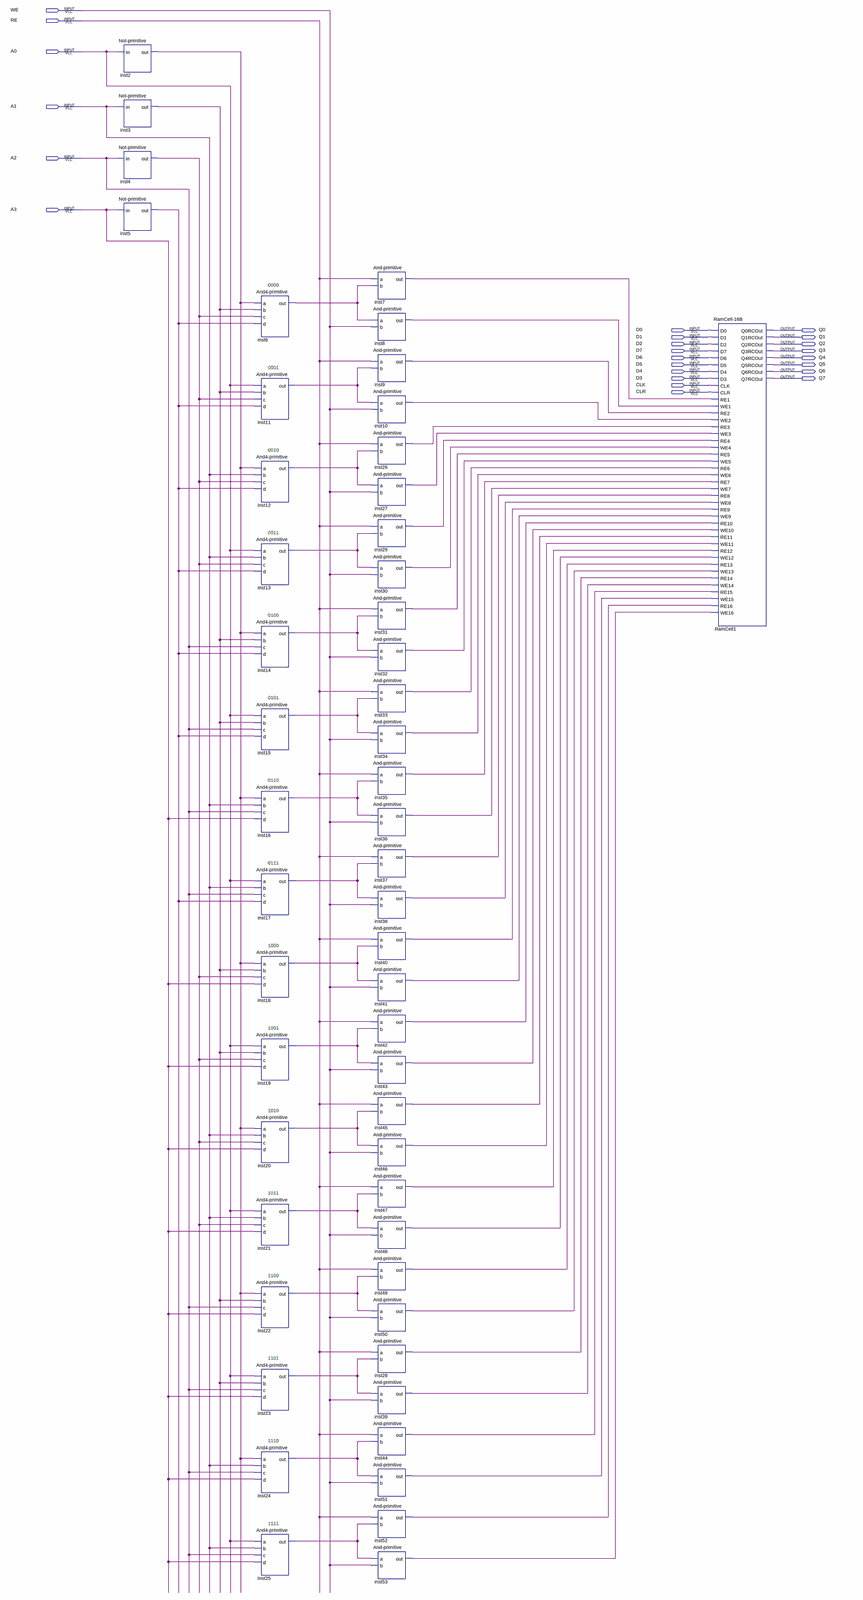
[diagram p0: schematic sheet, whole]
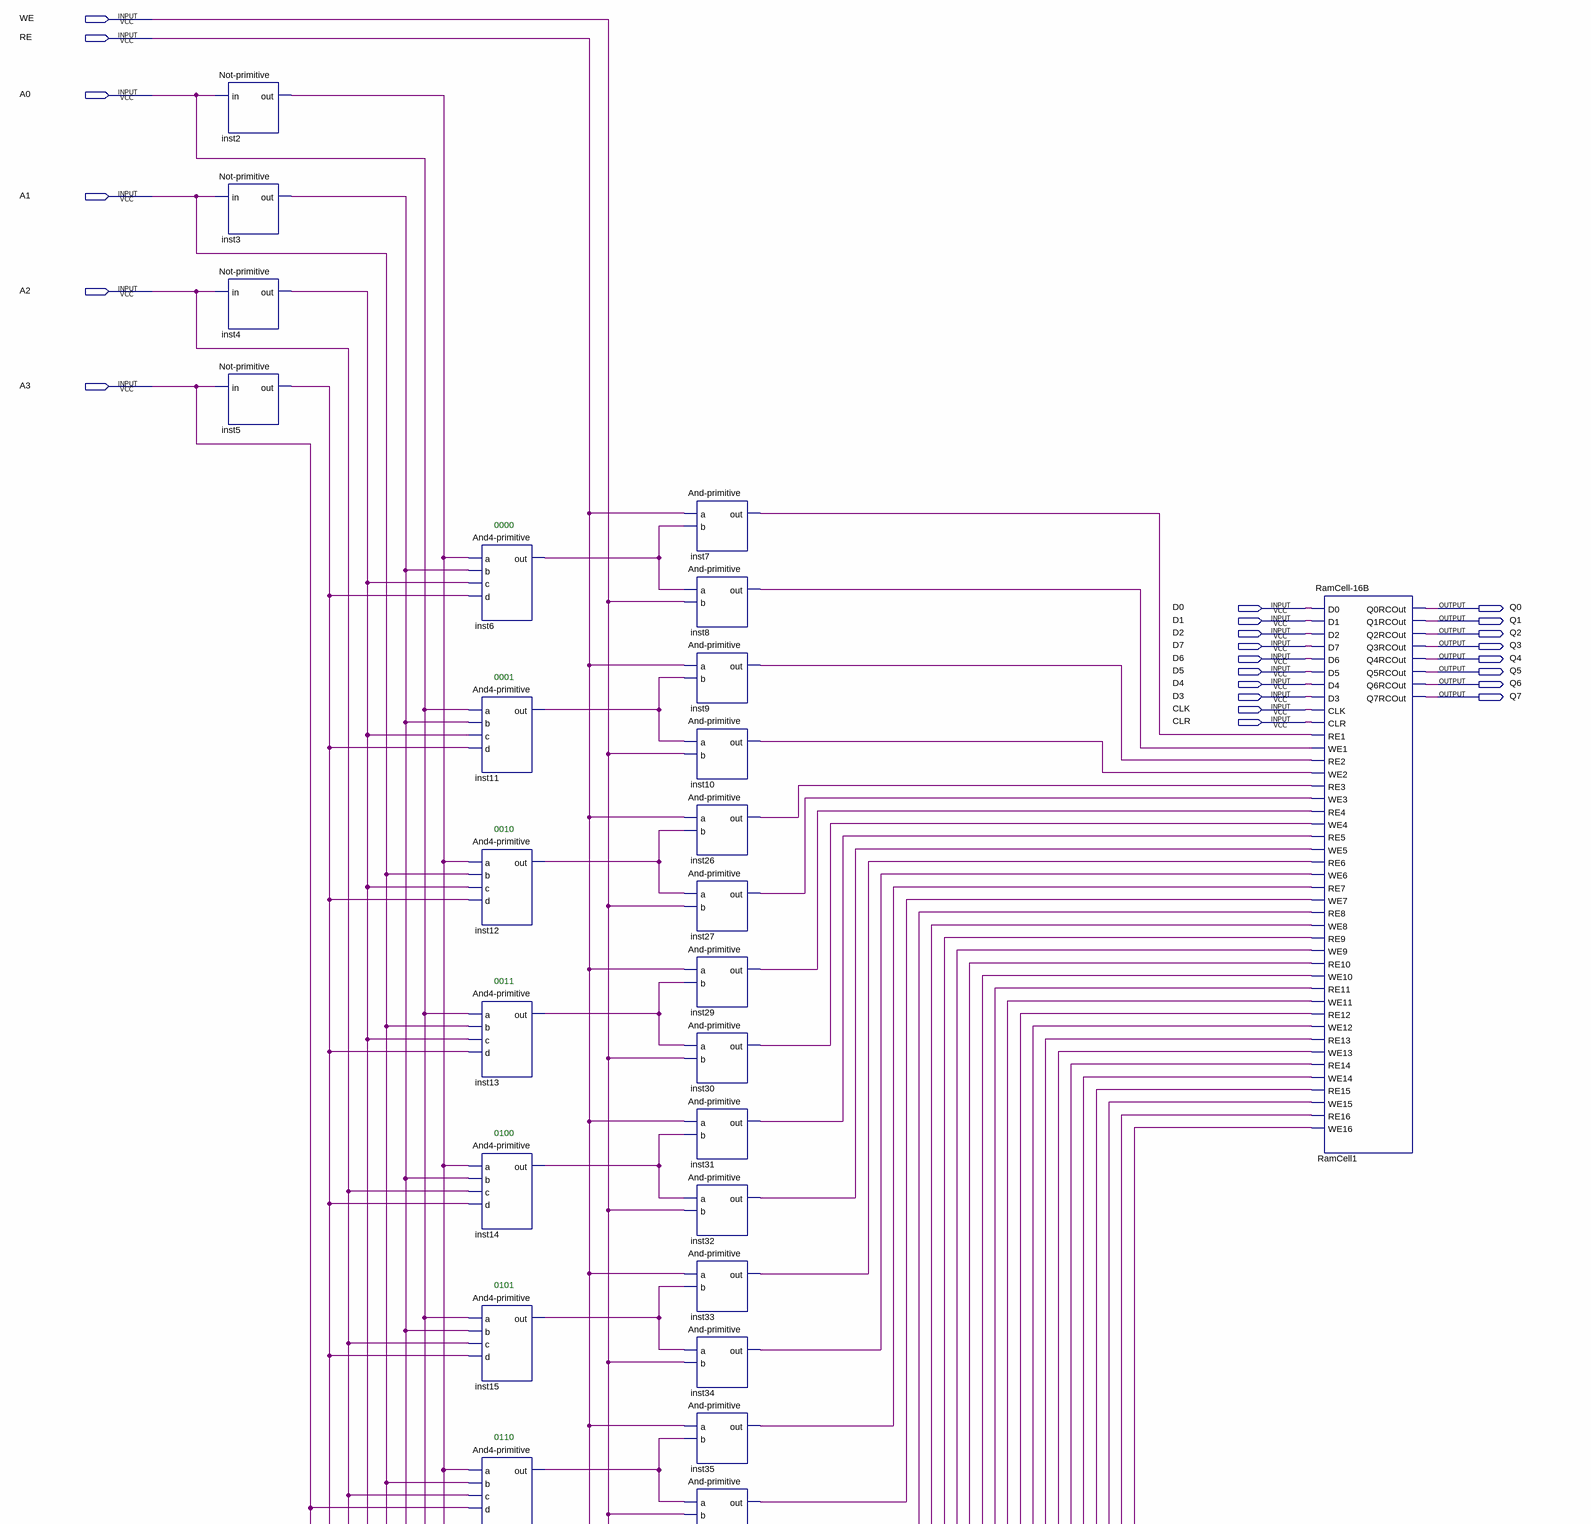
[diagram p1: schematic sheet, upper part]
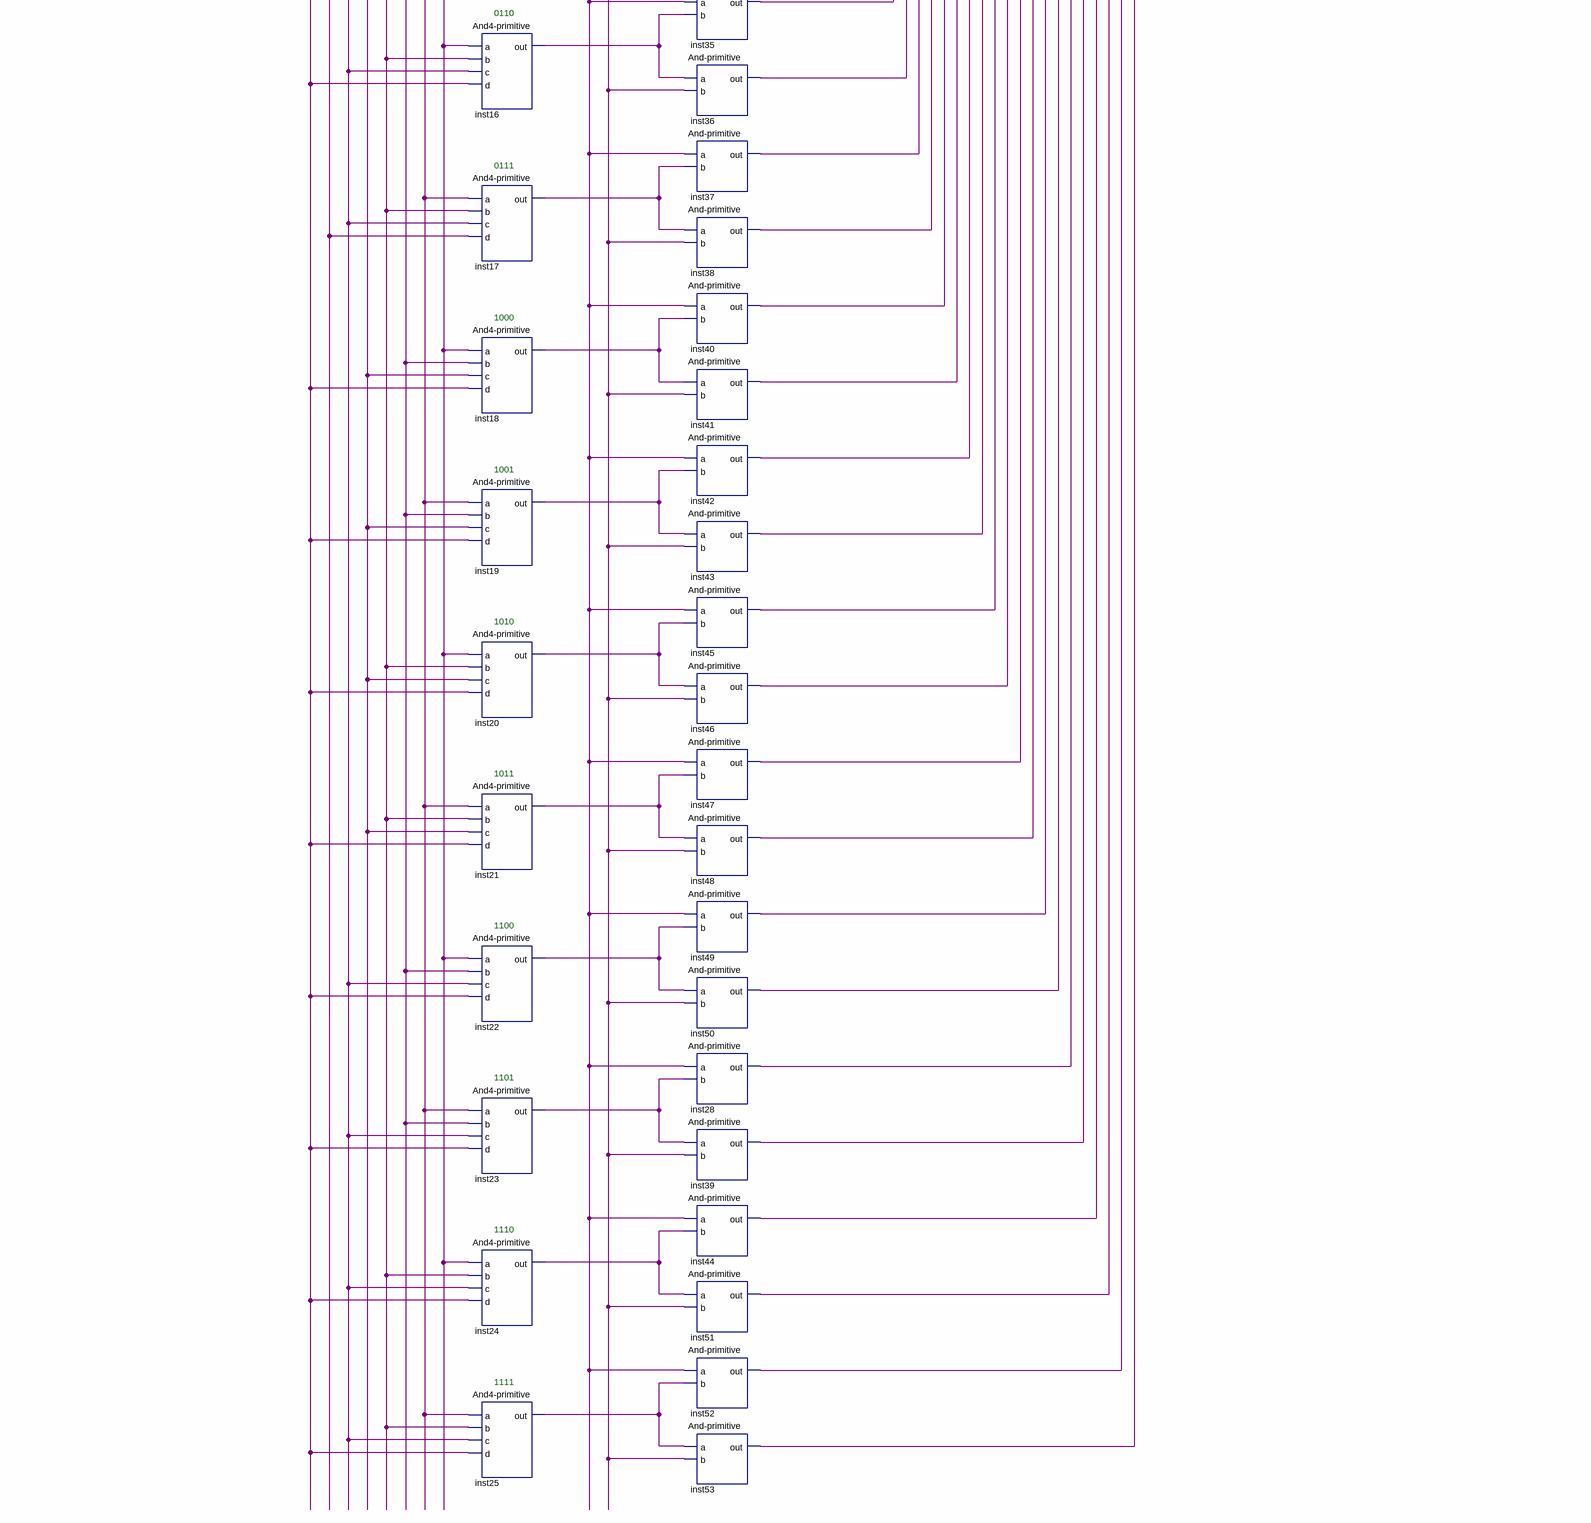
[diagram p2: schematic sheet, lower part]
// Quartus schematic RAM.bdf as structural Verilog: 53 symbols, 24 pins
module RAM (
  input  WE,
  input  RE,
  input  A0,
  input  A1,
  input  A2,
  input  A3,
  input  D0,
  input  D1,
  input  D2,
  input  D7,
  input  D6,
  input  D5,
  input  D4,
  input  D3,
  input  CLK,
  input  CLR,
  output Q0,
  output Q1,
  output Q2,
  output Q3,
  output Q4,
  output Q5,
  output Q6,
  output Q7
);

  wire inst2_out, inst3_out, inst4_out, inst5_out, inst6_out, inst7_out, inst8_out, inst9_out, inst10_out,
       inst11_out, inst12_out, inst13_out, inst14_out, inst15_out, inst16_out, inst17_out, inst18_out,
       inst19_out, inst20_out, inst21_out, inst22_out, inst23_out, inst24_out, inst25_out, inst26_out,
       inst27_out, inst28_out, inst29_out, inst30_out, inst31_out, inst32_out, inst33_out, inst34_out,
       inst35_out, inst36_out, inst37_out, inst38_out, inst39_out, inst40_out, inst41_out, inst42_out,
       inst43_out, inst44_out, inst45_out, inst46_out, inst47_out, inst48_out, inst49_out, inst50_out,
       inst51_out, inst52_out, inst53_out;

  \Not-primitive  inst2 (.in(A0), .out(inst2_out));
  \Not-primitive  inst3 (.in(A1), .out(inst3_out));
  \Not-primitive  inst4 (.in(A2), .out(inst4_out));
  \Not-primitive  inst5 (.in(A3), .out(inst5_out));
  \And4-primitive  inst6 (.a(inst2_out), .b(inst3_out), .c(inst4_out), .d(inst5_out), .out(inst6_out));
  \And4-primitive  inst11 (.a(A0), .b(inst3_out), .c(inst4_out), .d(inst5_out), .out(inst11_out));
  \And4-primitive  inst12 (.a(inst2_out), .b(A1), .c(inst4_out), .d(inst5_out), .out(inst12_out));
  \And4-primitive  inst13 (.a(A0), .b(A1), .c(inst4_out), .d(inst5_out), .out(inst13_out));
  \And4-primitive  inst14 (.a(inst2_out), .b(inst3_out), .c(A2), .d(inst5_out), .out(inst14_out));
  \And4-primitive  inst15 (.a(A0), .b(inst3_out), .c(A2), .d(inst5_out), .out(inst15_out));
  \And4-primitive  inst16 (.a(inst2_out), .b(A1), .c(A2), .d(A3), .out(inst16_out));
  \And4-primitive  inst17 (.a(A0), .b(A1), .c(A2), .d(inst5_out), .out(inst17_out));
  \And4-primitive  inst18 (.a(inst2_out), .b(inst3_out), .c(inst4_out), .d(A3), .out(inst18_out));
  \And4-primitive  inst19 (.a(A0), .b(inst3_out), .c(inst4_out), .d(A3), .out(inst19_out));
  \And4-primitive  inst20 (.a(inst2_out), .b(A1), .c(inst4_out), .d(A3), .out(inst20_out));
  \And4-primitive  inst21 (.a(A0), .b(A1), .c(inst4_out), .d(A3), .out(inst21_out));
  \And4-primitive  inst22 (.a(inst2_out), .b(inst3_out), .c(A2), .d(A3), .out(inst22_out));
  \And4-primitive  inst23 (.a(A0), .b(inst3_out), .c(A2), .d(A3), .out(inst23_out));
  \And4-primitive  inst24 (.a(inst2_out), .b(A1), .c(A2), .d(A3), .out(inst24_out));
  \And4-primitive  inst25 (.a(A0), .b(A1), .c(A2), .d(A3), .out(inst25_out));
  \And-primitive  inst7 (.a(RE), .b(inst6_out), .out(inst7_out));
  \And-primitive  inst8 (.a(inst6_out), .b(WE), .out(inst8_out));
  \And-primitive  inst9 (.a(RE), .b(inst11_out), .out(inst9_out));
  \And-primitive  inst10 (.a(inst11_out), .b(WE), .out(inst10_out));
  \And-primitive  inst26 (.a(RE), .b(inst12_out), .out(inst26_out));
  \And-primitive  inst27 (.a(inst12_out), .b(WE), .out(inst27_out));
  \And-primitive  inst29 (.a(RE), .b(inst13_out), .out(inst29_out));
  \And-primitive  inst30 (.a(inst13_out), .b(WE), .out(inst30_out));
  \And-primitive  inst31 (.a(RE), .b(inst14_out), .out(inst31_out));
  \And-primitive  inst32 (.a(inst14_out), .b(WE), .out(inst32_out));
  \And-primitive  inst33 (.a(RE), .b(inst15_out), .out(inst33_out));
  \And-primitive  inst34 (.a(inst15_out), .b(WE), .out(inst34_out));
  \And-primitive  inst35 (.a(RE), .b(inst16_out), .out(inst35_out));
  \And-primitive  inst36 (.a(inst16_out), .b(WE), .out(inst36_out));
  \And-primitive  inst37 (.a(RE), .b(inst17_out), .out(inst37_out));
  \And-primitive  inst38 (.a(inst17_out), .b(WE), .out(inst38_out));
  \And-primitive  inst40 (.a(RE), .b(inst18_out), .out(inst40_out));
  \And-primitive  inst41 (.a(inst18_out), .b(WE), .out(inst41_out));
  \And-primitive  inst42 (.a(RE), .b(inst19_out), .out(inst42_out));
  \And-primitive  inst43 (.a(inst19_out), .b(WE), .out(inst43_out));
  \And-primitive  inst45 (.a(RE), .b(inst20_out), .out(inst45_out));
  \And-primitive  inst46 (.a(inst20_out), .b(WE), .out(inst46_out));
  \And-primitive  inst47 (.a(RE), .b(inst21_out), .out(inst47_out));
  \And-primitive  inst48 (.a(inst21_out), .b(WE), .out(inst48_out));
  \And-primitive  inst49 (.a(RE), .b(inst22_out), .out(inst49_out));
  \And-primitive  inst50 (.a(inst22_out), .b(WE), .out(inst50_out));
  \And-primitive  inst28 (.a(RE), .b(inst23_out), .out(inst28_out));
  \And-primitive  inst39 (.a(inst23_out), .b(WE), .out(inst39_out));
  \And-primitive  inst44 (.a(RE), .b(inst24_out), .out(inst44_out));
  \And-primitive  inst51 (.a(inst24_out), .b(WE), .out(inst51_out));
  \And-primitive  inst52 (.a(RE), .b(inst25_out), .out(inst52_out));
  \And-primitive  inst53 (.a(inst25_out), .b(WE), .out(inst53_out));
  \RamCell-16B  RamCell1 (
    .D0(D0), .D1(D1), .D2(D2), .D7(D7), .D6(D6), .D5(D5), .D4(D4), .D3(D3), .CLK(CLK), .CLR(CLR),
    .RE1(inst7_out), .WE1(inst8_out), .RE2(inst9_out), .WE2(inst10_out), .RE3(inst26_out), .WE3(inst27_out),
    .RE4(inst29_out), .WE4(inst30_out), .RE5(inst31_out), .WE5(inst32_out), .RE6(inst33_out),
    .WE6(inst34_out), .RE7(inst35_out), .WE7(inst36_out), .RE8(inst37_out), .WE8(inst38_out),
    .RE9(inst40_out), .WE9(inst41_out), .RE10(inst42_out), .WE10(inst43_out), .RE11(inst45_out),
    .WE11(inst46_out), .RE12(inst47_out), .WE12(inst48_out), .RE13(inst49_out), .WE13(inst50_out),
    .RE14(inst28_out), .WE14(inst39_out), .RE15(inst44_out), .WE15(inst51_out), .RE16(inst52_out),
    .WE16(inst53_out), .Q0RCOut(Q0), .Q1RCOut(Q1), .Q2RCOut(Q2), .Q3RCOut(Q3), .Q4RCOut(Q4), .Q5RCOut(Q5),
    .Q6RCOut(Q6), .Q7RCOut(Q7));

  // Notes on the sheet:
  //   0000
  //   0001
  //   0010
  //   0011
  //   0100
  //   0101
  //   0110
  //   0111
  //   1000
  //   1001
  //   1010
  //   1011
  //   1100
  //   1101
  //   1110
  //   1111
endmodule
